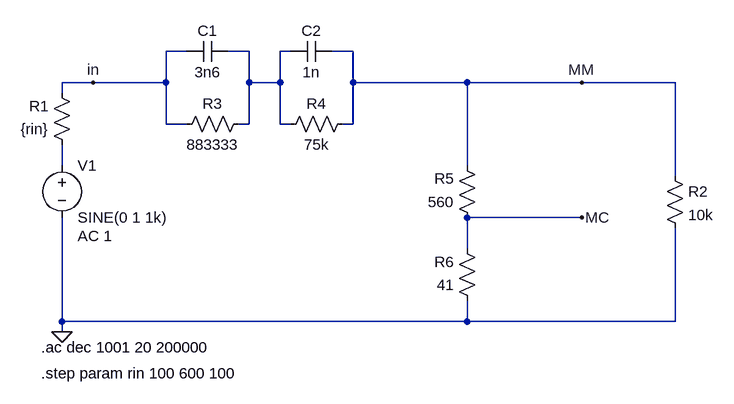
[diagram p0: schematic iriaa.asc]
iriaa.asc, the LTspice schematic file:
Version 4
SHEET 1 1060 680
WIRE 240 64 208 64
WIRE 336 64 304 64
WIRE 400 64 384 64
WIRE 496 64 464 64
WIRE 96 112 48 112
WIRE 208 112 208 64
WIRE 208 112 96 112
WIRE 336 112 336 64
WIRE 384 112 384 64
WIRE 384 112 336 112
WIRE 496 112 496 64
WIRE 672 112 496 112
WIRE 848 112 672 112
WIRE 992 112 848 112
WIRE 48 128 48 112
WIRE 208 176 208 112
WIRE 240 176 208 176
WIRE 336 176 336 112
WIRE 336 176 320 176
WIRE 384 176 384 112
WIRE 400 176 384 176
WIRE 496 176 496 112
WIRE 496 176 480 176
WIRE 48 240 48 208
WIRE 672 240 672 112
WIRE 992 256 992 112
WIRE 848 320 672 320
WIRE 672 368 672 320
WIRE 48 480 48 320
WIRE 672 480 672 448
WIRE 672 480 48 480
WIRE 992 480 992 336
WIRE 992 480 672 480
WIRE 48 496 48 480
FLAG 48 496 0
FLAG 848 112 MM
FLAG 848 320 MC
FLAG 96 112 in
SYMBOL cap 304 48 R90
WINDOW 0 0 32 VBottom 2
WINDOW 3 32 32 VTop 2
SYMATTR InstName C1
SYMATTR Value 3n6
SYMBOL cap 464 48 R90
WINDOW 0 0 32 VBottom 2
WINDOW 3 32 32 VTop 2
SYMATTR InstName C2
SYMATTR Value 1n
SYMBOL res 336 160 R90
WINDOW 0 0 56 VBottom 2
WINDOW 3 32 56 VTop 2
SYMATTR InstName R3
SYMATTR Value 883333
SYMBOL res 496 160 R90
WINDOW 0 0 56 VBottom 2
WINDOW 3 32 56 VTop 2
SYMATTR InstName R4
SYMATTR Value 75k
SYMBOL res 688 336 R180
WINDOW 0 36 76 Left 2
WINDOW 3 36 40 Left 2
SYMATTR InstName R5
SYMATTR Value 560
SYMBOL res 688 464 R180
WINDOW 0 36 76 Left 2
WINDOW 3 36 40 Left 2
SYMATTR InstName R6
SYMATTR Value 41
SYMBOL voltage 48 224 R0
WINDOW 123 24 124 Left 2
WINDOW 39 0 0 Left 0
SYMATTR Value2 AC 1
SYMATTR InstName V1
SYMATTR Value SINE(0 1 1k)
SYMBOL res 64 224 R180
WINDOW 0 36 76 Left 2
WINDOW 3 36 40 Left 2
SYMATTR InstName R1
SYMATTR Value {rin}
SYMBOL res 976 240 R0
SYMATTR InstName R2
SYMATTR Value 10k
TEXT 16 520 Left 2 !.ac dec 1001 20 200000
TEXT 16 560 Left 2 !.step param rin 100 600 100

The netlist it stands for:
* iriaa.asc
C1 N001 in 3n6
C2 MM N001 1n
R3 N001 in 883333
R4 MM N001 75k
R5 MC MM 560
R6 0 MC 41
V1 N002 0 SINE(0 1 1k) AC 1
R1 N002 in {rin}
R2 MM 0 10k
.ac dec 1001 20 200000
.step param rin 100 600 100
.backanno
.end